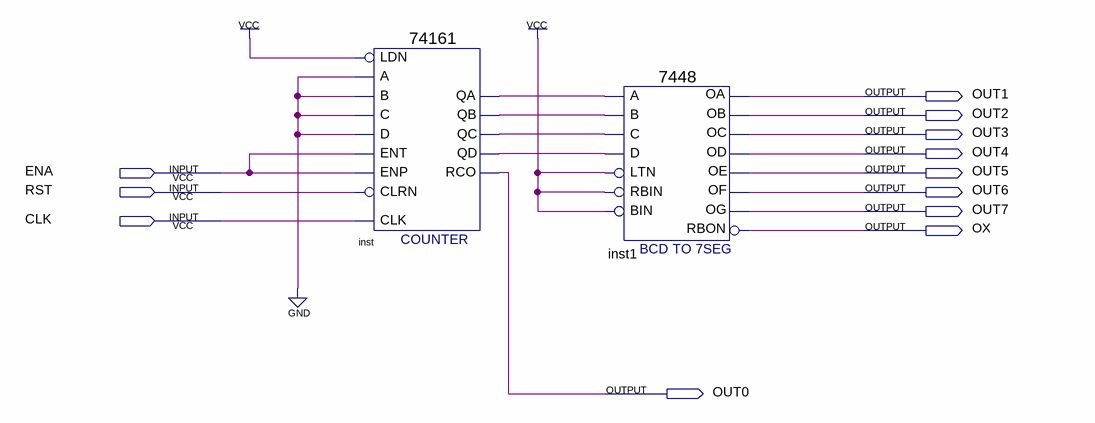
[diagram p0: schematic sheet]
// Quartus schematic TTXX1.bdf as structural Verilog: 2 symbols, 12 pins
module TTXX1 (
  input  ENA,
  input  RST,
  input  CLK,
  output OUT1,
  output OUT2,
  output OUT3,
  output OUT4,
  output OUT5,
  output OUT6,
  output OUT7,
  output OX,
  output OUT0
);

  wire inst_qa, inst_qb, inst_qc, inst_qd;

  \74161  inst (
    .CLRN(RST), .CLK(CLK), .ENP(ENA), .LDN(1'b1), .A(1'b0), .D(1'b0), .ENT(ENA), .B(1'b0), .C(1'b0),
    .QD(inst_qd), .QC(inst_qc), .QB(inst_qb), .QA(inst_qa), .RCO(OUT0));
  \7448  inst1 (
    .A(inst_qa), .C(inst_qc), .D(inst_qd), .B(inst_qb), .RBIN(1'b1), .BIN(1'b1), .LTN(1'b1), .OC(OUT3),
    .OE(OUT5), .OD(OUT4), .OF(OUT6), .OG(OUT7), .OB(OUT2), .OA(OUT1), .RBON(OX));
endmodule
